# EAGLE design lm324 (EAGLE 7.1.0)
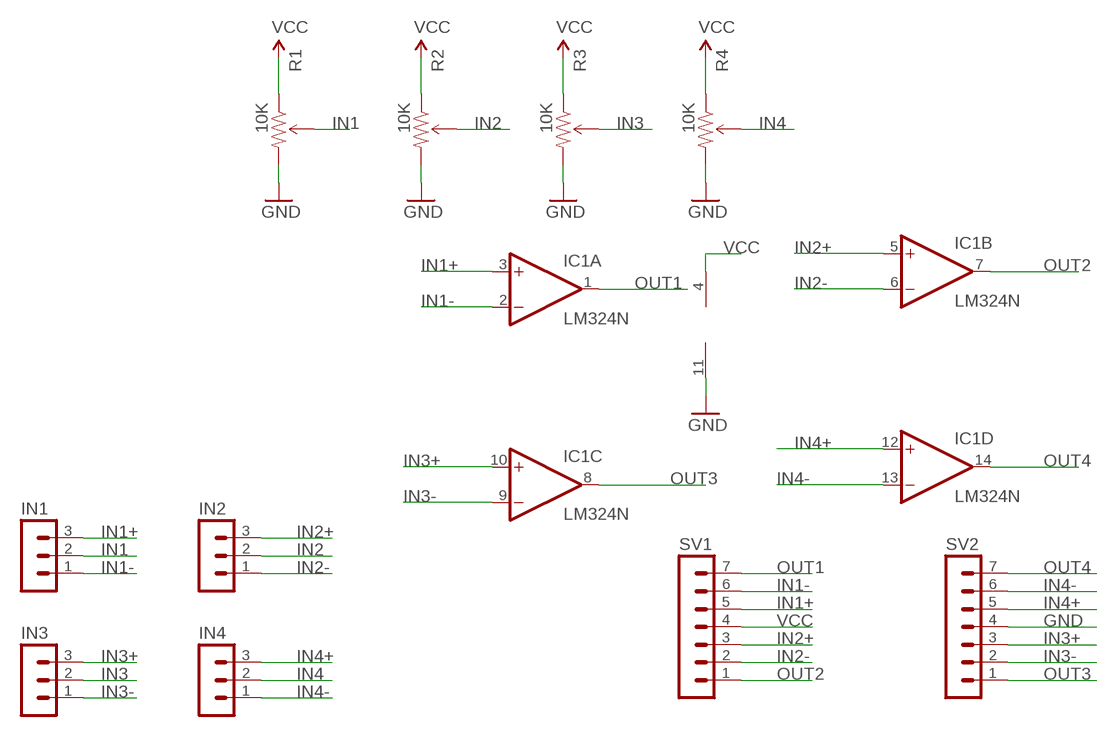
[diagram p0: schematic, sheet 1]

## Parts
IC1  LM324N  [DIL14]
IN1  MA03-1  [MA03-1]
IN2  MA03-1  [MA03-1]
IN3  MA03-1  [MA03-1]
IN4  MA03-1  [MA03-1]
R1  10K  TRIMPOTPTH  [TRIM_POT_PTH]
R2  10K  TRIMPOTPTH  [TRIM_POT_PTH]
R3  10K  TRIMPOTPTH  [TRIM_POT_PTH]
R4  10K  TRIMPOTPTH  [TRIM_POT_PTH]
SV1  MA07-1  [MA07-1]
SV2  MA07-1  [MA07-1]

## Nets
GND: IC1.11(P:V-) R1.3(CW) R2.3(CW) R3.3(CW) R4.3(CW) SV2.4
IN1: IN1.2 R1.2(WIPER)
IN1+: IC1.3(A:+IN) IN1.3 SV1.5
IN1-: IC1.2(A:-IN) IN1.1 SV1.6
IN2: IN2.2 R2.2(WIPER)
IN2+: IC1.5(B:+IN) IN2.3 SV1.3
IN2-: IC1.6(B:-IN) IN2.1 SV1.2
IN3: IN3.2 R3.2(WIPER)
IN3+: IC1.10(C:+IN) IN3.3 SV2.3
IN3-: IC1.9(C:-IN) IN3.1 SV2.2
IN4: IN4.2 R4.2(WIPER)
IN4+: IC1.12(D:+IN) IN4.3 SV2.5
IN4-: IC1.13(D:-IN) IN4.1 SV2.6
OUT1: IC1.1(A:OUT) SV1.7
OUT2: IC1.7(B:OUT) SV1.1
OUT3: IC1.8(C:OUT) SV2.1
OUT4: IC1.14(D:OUT) SV2.7
VCC: IC1.4(P:V+) R1.1(CCW) R2.1(CCW) R3.1(CCW) R4.1(CCW) SV1.4

## Library data of the parts
IC1 = linear:LM324: OP AMP
IN1-IN4 = con-lstb:MA03-1: PIN HEADER; OC_FARNELL: unknown; OC_NEWARK: unknown
R1-R4 = SparkFun-Electromechanical:TRIMPOT: Various small potentiometers for "set-and-forget" applications
SV1 SV2 = con-lstb:MA07-1: PIN HEADER; OC_FARNELL: unknown; OC_NEWARK: unknown

## Board
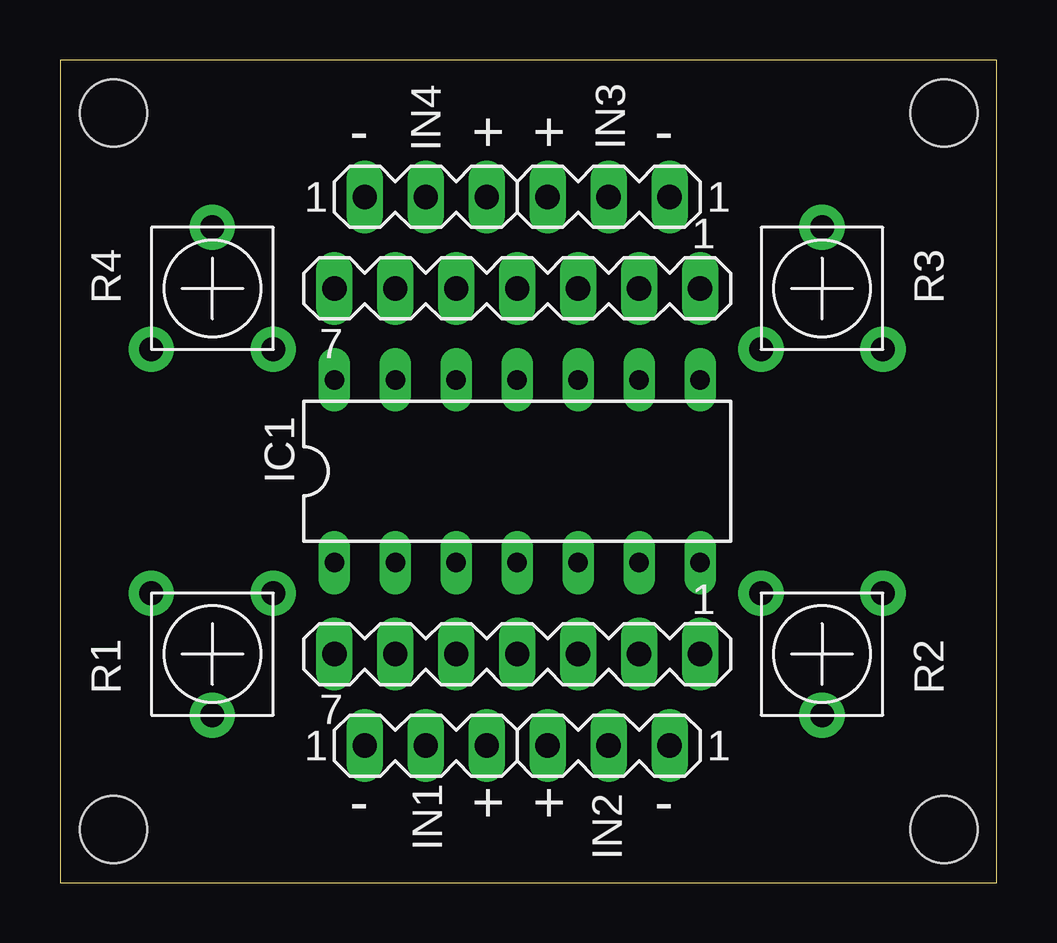
[diagram p1: board, top side]
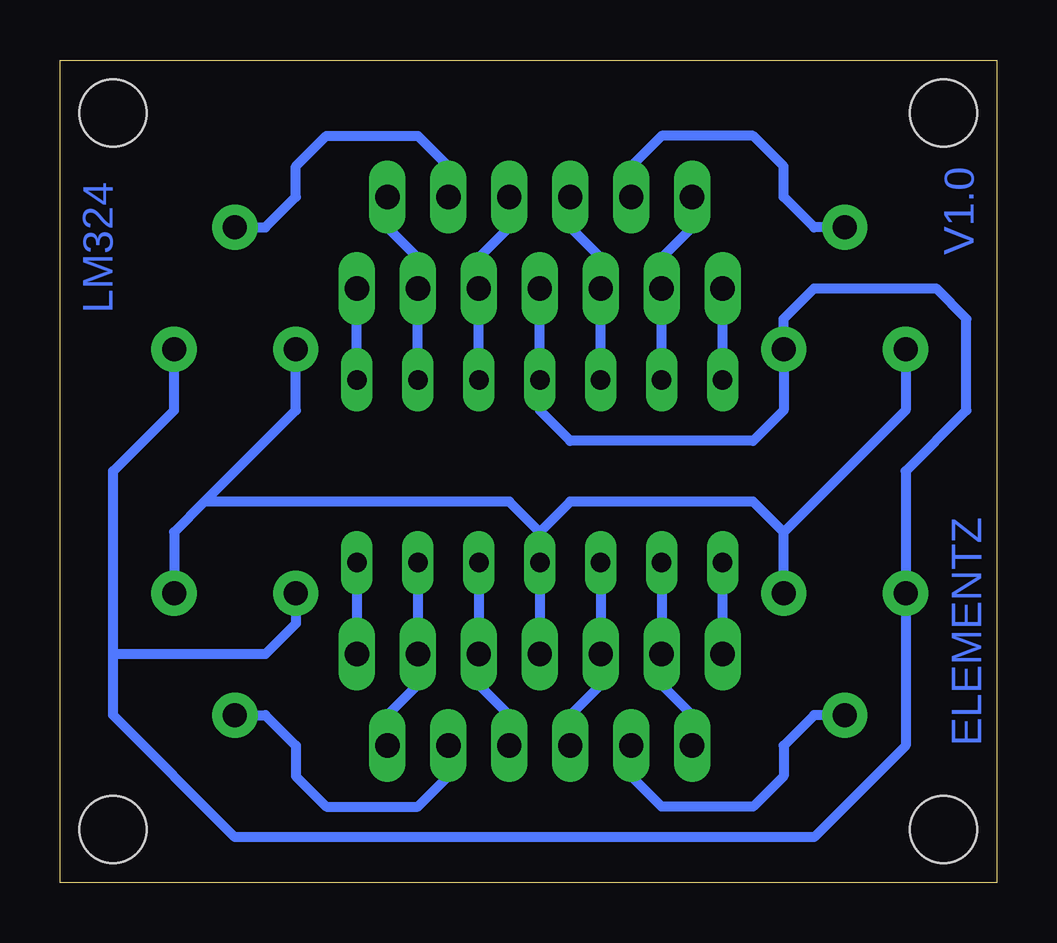
[diagram p2: board, bottom side, seen from below]

Size 39.04 x 34.28 mm. Coordinates in mm from the lower left corner, seen from the top.
Outline: 0,0 39.04,0 39.04,34.28 0,34.28 0,0
Copper layers (1*16): Top 0.035mm / dielectric 1.5mm / Bottom 0.035mm
Design rules "default": minimum track width 10mil, minimum drill 24mil, track to track 8mil, track to pad 8mil, pad to pad 8mil, via to via 8mil, smd to smd 8mil, copper to edge 40mil, drill to drill 8mil, minimum pad ring 10mil, minimum via ring 8mil, stop-mask expansion 4mil, vias tented up to drill 0mil, thermal gap 10mil
Holes 2.8 mm at 2.22,32.07 36.83,32.07 36.83,2.22 2.22,2.22

### Footprints (pad centres in the part's own frame; a part is rotated, then mirrored left to right if it is on the bottom)
DIL14 = drill 0.813 long: 1 -7.62,-3.81; 2 -5.08,-3.81; 3 -2.54,-3.81; 4 0,-3.81; 5 2.54,-3.81; 6 5.08,-3.81; 7 7.62,-3.81; 8 7.62,3.81; 9 5.08,3.81; 10 2.54,3.81; 11 0,3.81; 12 -2.54,3.81; 13 -5.08,3.81; 14 -7.62,3.81
MA03-1 = drill 1.016 long: 1 -2.54,0; 2 0,0; 3 2.54,0
TRIM_POT_PTH = drill 1 pad 1.88: 1 -2.54,-2.54; 2 0,2.54; 3 2.54,-2.54
MA07-1 = drill 1.016 long: 1 -7.62,0; 2 -5.08,0; 3 -2.54,0; 4 0,0; 5 2.54,0; 6 5.08,0; 7 7.62,0

### Placement (x,y rotation side)
IC1  19.05,17.14 0 top
IN1  15.24,5.71 0 top
IN2  22.86,5.71 180 top
IN3  22.86,28.57 180 top
IN4  15.24,28.57 0 top
R1  6.35,9.53 180 top
R2  31.75,9.53 180 top
R3  31.75,24.77 0 top
R4  6.35,24.77 0 top
SV1  19.05,9.53 180 top
SV2  19.05,24.77 180 top

### Tracks (layer width: path | path; a pad name or v marks a point on that pad's centre or on a via)
GND
  Bottom 0.406: SV2.4 IC1.11 19.05,19.68 17.78,18.41 10.16,18.41 8.89,19.68 R4.3 8.89,23.5 7.62,24.77 2.54,24.77 1.27,23.5 1.27,19.68 3.81,17.14 R1.3 3.81,5.71 7.62,1.91 31.75,1.91 36.83,6.99 36.83,9.53 | 36.83,9.53 36.83,17.14 34.29,19.68 R3.3 | R2.3 29.21,10.79 30.48,9.53 36.83,9.53
IN1
  Bottom 0.406: IN1.2 15.24,4.45 13.97,3.17 10.16,3.17 8.89,4.45 8.89,5.71 7.62,6.99 R1.2
IN1+
  Bottom 0.406: IC1.3 SV1.5 16.51,8.26 17.78,6.99 IN1.3
IN1-
  Bottom 0.406: IC1.2 SV1.6 13.97,8.26 12.7,6.99 IN1.1
IN2
  Bottom 0.406: R2.2 30.48,6.99 29.21,5.71 29.21,4.45 27.94,3.17 24.13,3.17 22.86,4.45 IN2.2
IN2+
  Bottom 0.406: IC1.5 SV1.3 21.59,8.26 20.32,6.99 IN2.3
IN2-
  Bottom 0.406: IC1.6 SV1.2 24.13,8.26 25.4,6.99 IN2.1
IN3
  Bottom 0.406: R3.2 30.48,27.3 29.21,28.57 29.21,29.84 27.94,31.11 24.13,31.11 22.86,29.84 IN3.2 22.86,27.3
IN3+
  Bottom 0.406: IC1.10 SV2.3 21.59,26.04 20.32,27.3 IN3.3
IN3-
  Bottom 0.406: IC1.9 SV2.2 24.13,26.04 25.4,27.3 IN3.1
IN4
  Bottom 0.406: R4.2 7.62,27.3 8.89,28.57 8.89,29.84 10.16,31.11 13.97,31.11 15.24,29.84 IN4.2
IN4+
  Bottom 0.406: IC1.12 SV2.5 16.51,26.04 17.78,27.3 IN4.3
IN4-
  Bottom 0.406: IC1.13 SV2.6 13.97,26.04 12.7,27.3 IN4.1
OUT1
  Bottom 0.406: SV1.7 IC1.1
OUT2
  Bottom 0.406: IC1.7 SV1.1
OUT3
  Bottom 0.406: IC1.8 SV2.1
OUT4
  Bottom 0.406: IC1.14 SV2.7
VCC
  Bottom 0.406: SV1.4 IC1.4 19.05,14.61 | R4.1 3.81,19.68 8.89,14.61 | R1.1 8.89,14.61 | 8.89,14.61 10.16,15.88 17.78,15.88 19.05,14.61 | 19.05,14.61 20.32,15.88 33.02,15.88 | 33.02,15.88 34.29,14.61 R2.1 | 33.02,15.88 29.21,19.68 R3.1

### Text on the board
Bottom: V1.0 | LM324 | ELEMENTZ
tNames: - | + | + | - | - | + | + | -